# EAGLE schematic comparator (EAGLE 6.4)
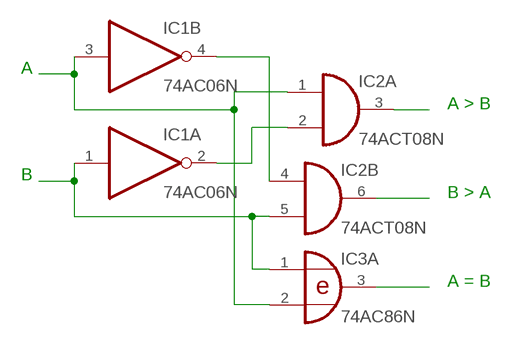
[diagram p0: schematic, sheet 1]

## Parts
IC1  74AC06N  [DIL14]
IC2  74ACT08N  [DIL14]
IC3  74AC86N  [DIL14]

## Nets
N$1: IC1.1(A:I) IC2.5(B:I1) IC3.1(A:I0)
N$2: IC1.3(B:I) IC2.1(A:I0) IC3.2(A:I1)
N$3: IC1.2(A:O) IC2.2(A:I1)
N$4: IC1.4(B:O) IC2.4(B:I0)
N$5: IC2.6(B:O)
N$6: IC2.3(A:O)
N$7: IC3.3(A:O)
Unconnected: IC1.5(C:I) IC1.6(C:O) IC1.8(D:O) IC1.9(D:I) IC1.10(E:O) IC1.11(E:I) IC1.12(F:O) IC1.13(F:I) IC2.8(C:O) IC2.9(C:I0) IC2.10(C:I1) IC2.11(D:O) IC2.12(D:I0) IC2.13(D:I1) IC3.4(B:I0) IC3.5(B:I1) IC3.6(B:O) IC3.8(C:O) IC3.9(C:I0) IC3.10(C:I1) IC3.11(D:O) IC3.12(D:I0) IC3.13(D:I1)

## Notes on the sheet
- A
- A > B
- B
- B > A
- A = B

## Power pins joined to a net without a drawn wire
GND: IC1.7(P:GND) IC2.7(P:GND) IC3.7(P:GND)
VCC: IC1.14(P:VCC) IC2.14(P:VCC) IC3.14(P:VCC)

## Library data of the parts
IC1 = 74xx-eu:74*06: Hex INVERTER, open collector high-voltage output
IC2 = 74xx-eu:74*08: Quad 2-input AND gate
IC3 = 74xx-eu:74*86: Quad 2-input EXCLUSIVE-OR (XOR) gate